# Altium schematic sheet USB.SchDoc
size A4
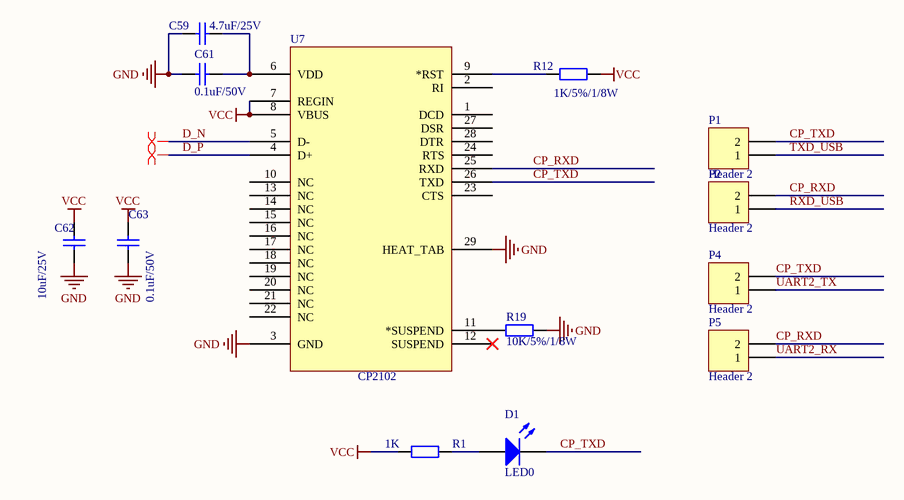
[diagram p0: USB.SchDoc]

## Parts
C59  4.7uF/25V  [0603C]
C61  0.1uF/50V  [0402C]
C62  10uF/25V  [0603C]
C63  0.1uF/50V  [0402C]
D1  LED0  [0603LED]
P1  Header 2  [HDR1X2]
P2  Header 2  [HDR1X2]
P4  Header 2  [HDR1X2]
P5  Header 2  [HDR1X2]
R1  1K  [0402R]
R12  1K/5%/1/8W  [0402R]
R19  10K/5%/1/8W  [0402R]
U7  CP2102  [QFN28N5X5-0p5P-L]

## Nets
GND: C59.1 C61.2 C62.2 C63.2 R19.1 U7.3(GND) U7.29(HEAT_TAB)
VCC: C62.1 C63.1 R1.1 R12.1 U7.7(REGIN) U7.8(VBUS)
CP_RXD: P2.2 P5.2 U7.25(RXD)
CP_TXD: D1.2(K) P1.2 P4.2 U7.26(TXD)
D_N: U7.5(D-)
D_P: U7.4(D+)
RXD_USB: P2.1
TXD_USB: P1.1
UART2_RX: P5.1
UART2_TX: P4.1
NetC59_2: C59.2 C61.1 U7.6(VDD)
NetD1_1: D1.1(A) R1.2
NetR12_2: R12.2 U7.9(*RST)
NetR19_2: R19.2 U7.11(*SUSPEND)

Not connected (* = marked no-connect by the designer): U7 1(DCD) 2(RI) 10(NC) 12(SUSPEND)* 13(NC) 14(NC) 15(NC) 16(NC) 17(NC) 18(NC) 19(NC) 20(NC) 21(NC) 22(NC) 23(CTS) 24(RTS) 27(DSR) 28(DTR)

## Layout directives
differential pair: D_N, D_P

## Library data of the parts
C59 = Cap: Capacitor; Value: 1uF; Published: 8-Jun-2000; LatestRevisionDate: 17-Jul-2002; LatestRevisionNote: Re-released for DXP Platform.; PackageReference: RAD-0.3; Publisher: Altium Limited
C61 C63 = Cap: Capacitor; Value: 104; Published: 8-Jun-2000; LatestRevisionDate: 17-Jul-2002; LatestRevisionNote: Re-released for DXP Platform.; PackageReference: RAD-0.3; Publisher: Altium Limited
C62 = Cap: Capacitor; Value: 106; Published: 8-Jun-2000; LatestRevisionDate: 17-Jul-2002; LatestRevisionNote: Re-released for DXP Platform.; PackageReference: RAD-0.3; Publisher: Altium Limited
D1 = LED0: Typical INFRARED GaAs LED; Published: 8-Jun-2000; LatestRevisionDate: 08-Jul-2005; LatestRevisionNote: Mech Layer 1 removed.; PackageReference: LED-0; Publisher: Altium Limited
P1 P2 P4 P5 = Header 2: Header, 2-Pin; LatestRevisionDate: 17-Jul-2002; LatestRevisionNote: Re-released for DXP Platform.; Publisher: Altium Limited
R1 = Resistor: Resistor SMD - IEC symbol version; Value: NC; LatestRevisionDate: 27-Jul-20  -  Semtech
R12 = Res2: Resistor; Value: 1K; Published: 8-Jun-2000; LatestRevisionDate: 17-Jul-2002; LatestRevisionNote: Re-released for DXP Platform.; PackageReference: AXIAL-0.4; Publisher: Altium Limited
R19 = Res2: Resistor; Published: 8-Jun-2000; LatestRevisionDate: 17-Jul-2002; LatestRevisionNote: Re-released for DXP Platform.; PackageReference: AXIAL-0.4; Publisher: Altium Limited; Value: 10K/5%/1/8W
U7 = CP2102: Imported; PART DESC: SINGLE-CHIP USB TO UART BRIDGE, QFN28, RoHS.; MFG #1: SILICON LABS; PART NUMBER: CP2102; Value: Value; RefDes: RefDes; Type: DEV